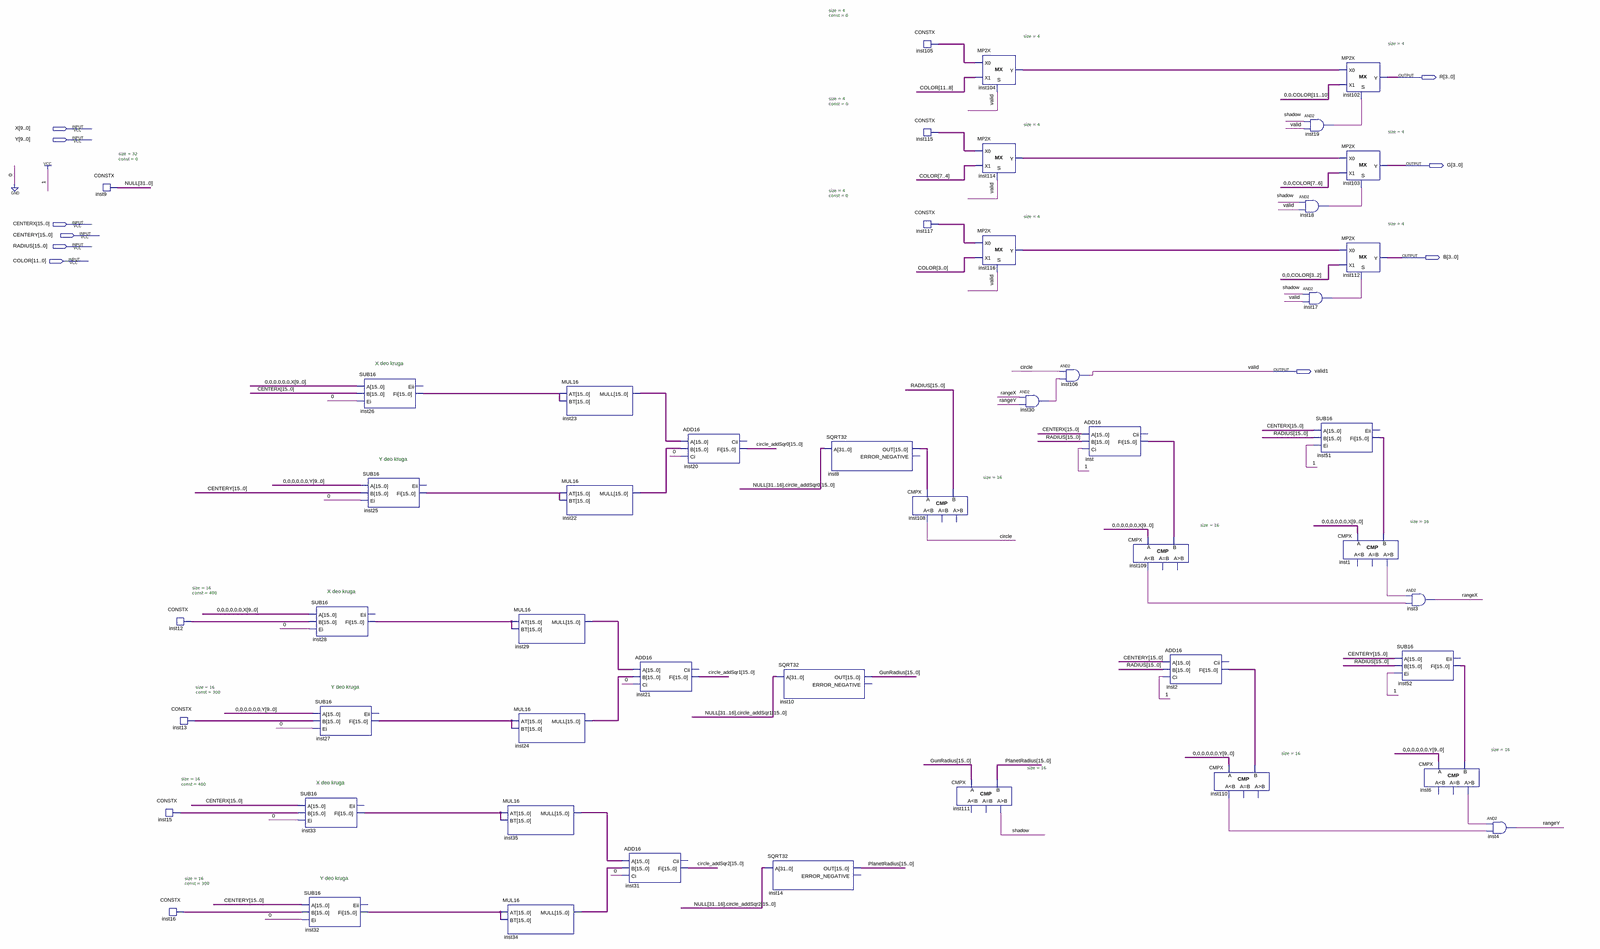
[diagram p0: schematic sheet, whole]
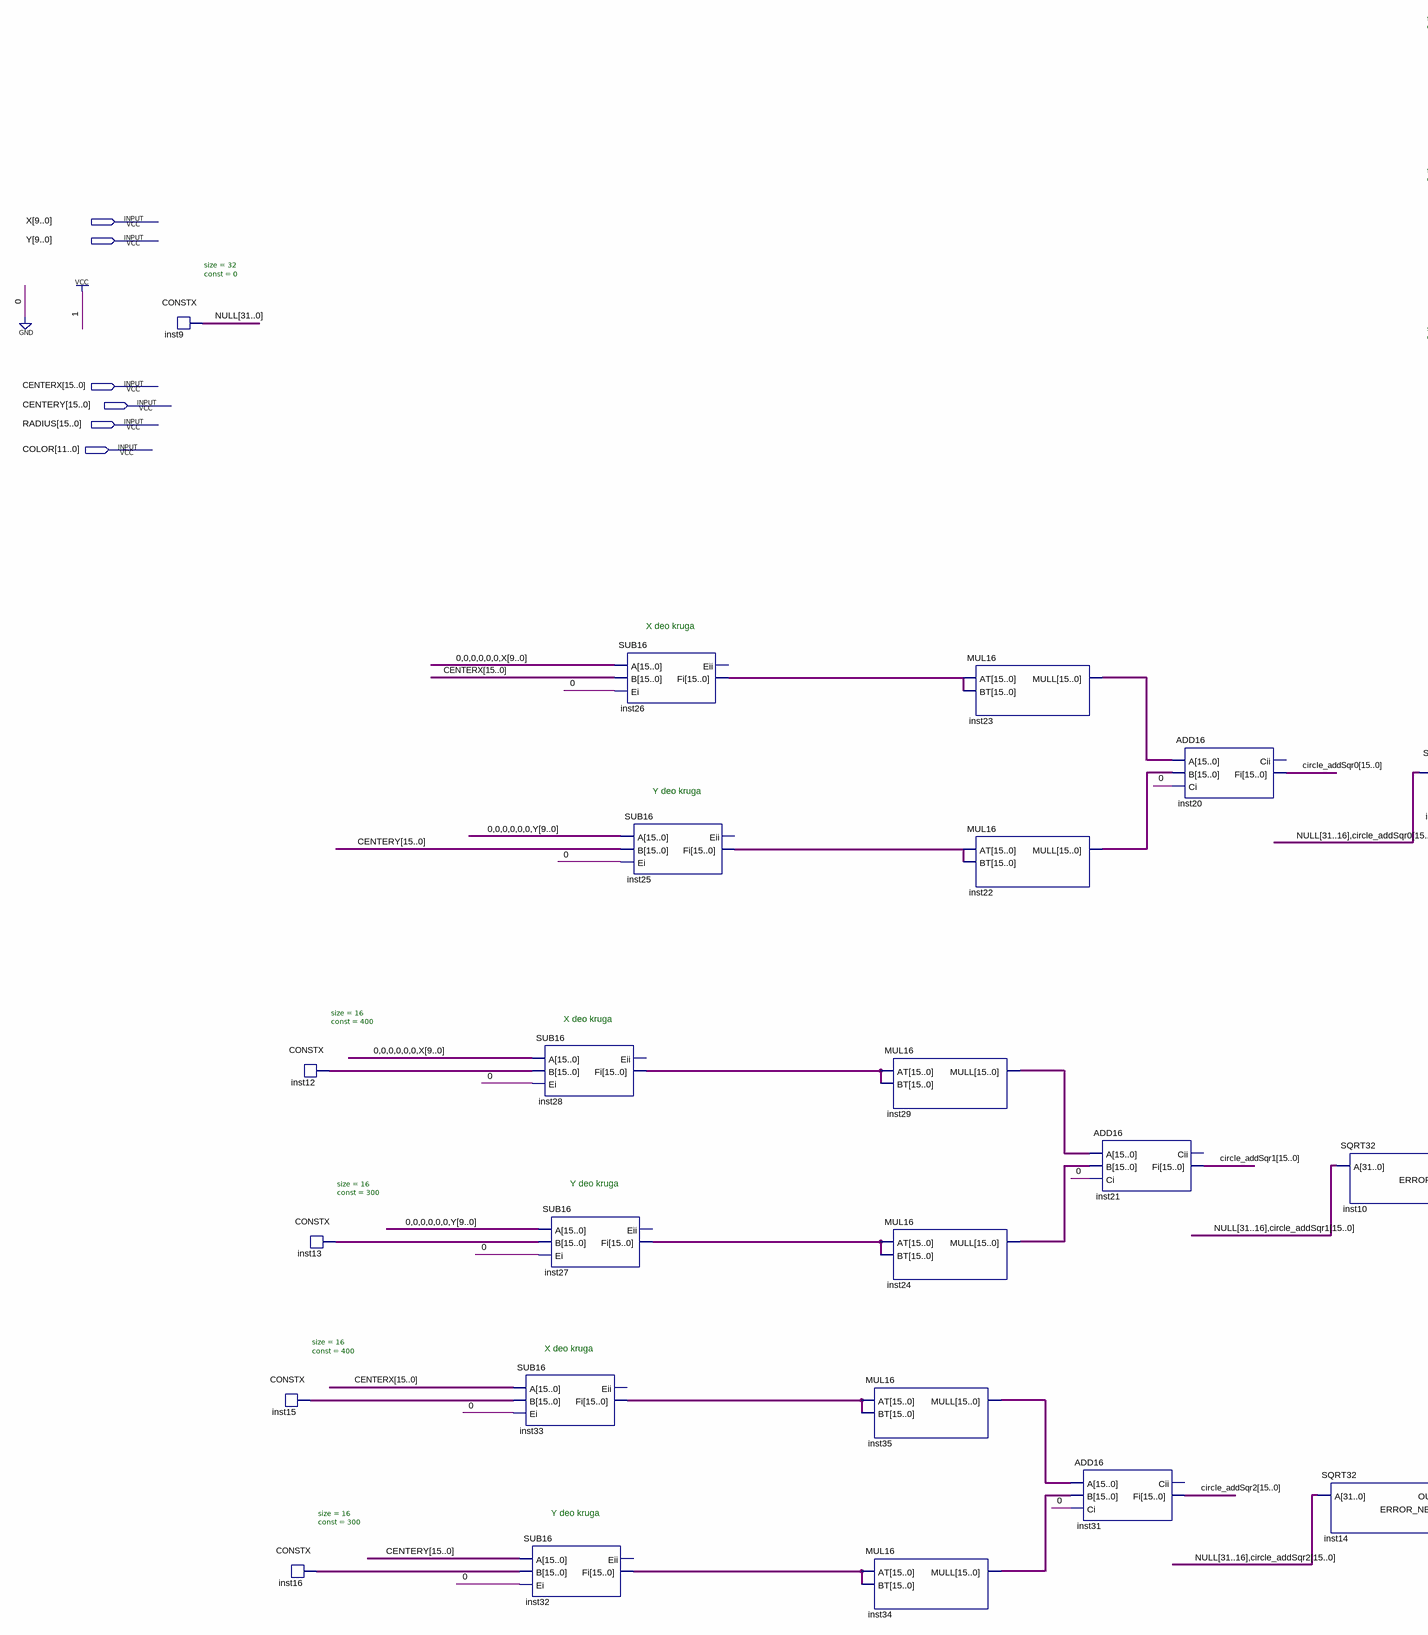
[diagram p1: schematic sheet, left part]
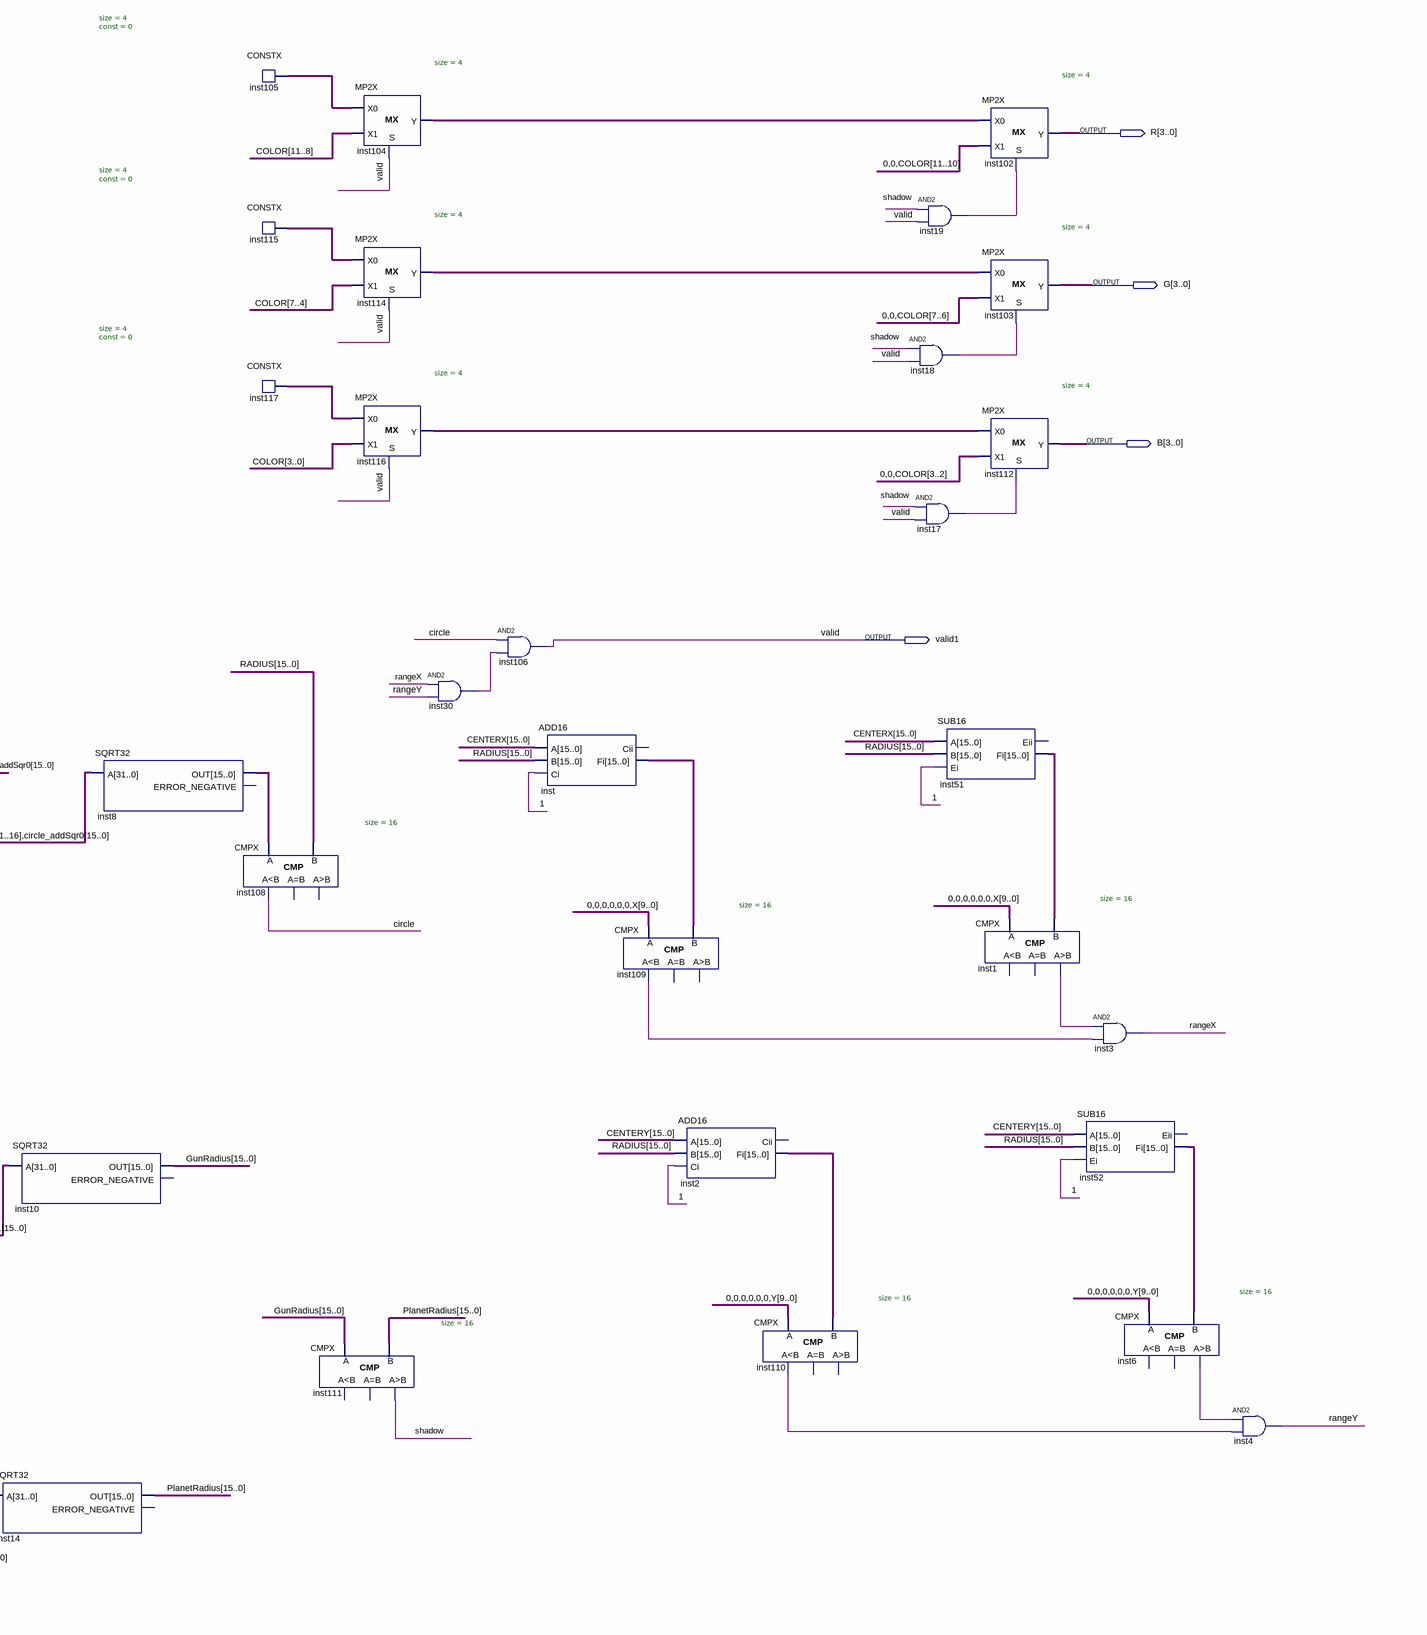
[diagram p2: schematic sheet, right part]
// Quartus schematic drawPlanet.bdf as structural Verilog: 49 symbols, 10 pins
module drawPlanet (
  input  [9:0] X,
  input  [9:0] Y,
  input  [15:0] CENTERX,
  input  [15:0] CENTERY,
  input  [15:0] RADIUS,
  input  [11:0] COLOR,
  output [3:0] R,
  output [3:0] G,
  output [3:0] B,
  output valid1
);

  wire circle, inst1_gr, inst6_gr, inst17_out, inst18_out, inst19_out, inst30_out, inst109_ls, inst110_ls,
       rangeX, rangeY, shadow;
  wire [3:0] inst104_y, inst105_data, inst114_y, inst115_data, inst116_y, inst117_data;
  wire [15:0] circle_addSqr0, circle_addSqr1, circle_addSqr2, GunRadius, inst2_fi, inst8_out, inst12_data,
       inst13_data, inst15_data, inst16_data, inst22_mull, inst23_mull, inst24_mull, inst25_fi, inst26_fi,
       inst27_fi, inst28_fi, inst29_mull, inst32_fi, inst33_fi, inst34_mull, inst35_mull, inst51_fi,
       inst52_fi, inst_fi, PlanetRadius;
  wire [31:0] NULL;

  CONSTX #(.size(32), .\const (0)) inst9 (.data(NULL));
  CONSTX #(.size(16), .\const (400)) inst12 (.data(inst12_data));
  CONSTX #(.size(16), .\const (300)) inst13 (.data(inst13_data));
  CONSTX #(.size(16), .\const (400)) inst15 (.data(inst15_data));
  CONSTX #(.size(16), .\const (300)) inst16 (.data(inst16_data));
  SUB16 inst28 (.A({{6{1'b0}}, X}), .B(inst12_data), .Ei(1'b0), .Fi(inst28_fi));  // open: Eii
  SUB16 inst27 (.A({{6{1'b0}}, Y}), .B(inst13_data), .Ei(1'b0), .Fi(inst27_fi));  // open: Eii
  SUB16 inst33 (.A(CENTERX), .B(inst15_data), .Ei(1'b0), .Fi(inst33_fi));  // open: Eii
  SUB16 inst32 (.A(CENTERY), .B(inst16_data), .Ei(1'b0), .Fi(inst32_fi));  // open: Eii
  SUB16 inst26 (.A({{6{1'b0}}, X}), .B(CENTERX), .Ei(1'b0), .Fi(inst26_fi));  // open: Eii
  SUB16 inst25 (.A({{6{1'b0}}, Y}), .B(CENTERY), .Ei(1'b0), .Fi(inst25_fi));  // open: Eii
  MUL16 inst35 (.AT(inst33_fi), .BT(inst33_fi), .MULL(inst35_mull));
  MUL16 inst34 (.AT(inst32_fi), .BT(inst32_fi), .MULL(inst34_mull));
  MUL16 inst29 (.AT(inst28_fi), .BT(inst28_fi), .MULL(inst29_mull));
  MUL16 inst24 (.AT(inst27_fi), .BT(inst27_fi), .MULL(inst24_mull));
  MUL16 inst23 (.AT(inst26_fi), .BT(inst26_fi), .MULL(inst23_mull));
  MUL16 inst22 (.AT(inst25_fi), .BT(inst25_fi), .MULL(inst22_mull));
  ADD16 inst21 (.A(inst29_mull), .B(inst24_mull), .Ci(1'b0), .Fi(circle_addSqr1));  // open: Cii
  ADD16 inst31 (.A(inst35_mull), .B(inst34_mull), .Ci(1'b0), .Fi(circle_addSqr2));  // open: Cii
  ADD16 inst20 (.A(inst23_mull), .B(inst22_mull), .Ci(1'b0), .Fi(circle_addSqr0));  // open: Cii
  SQRT32 inst14 (.A({NULL[31:16], circle_addSqr2}), .OUT(PlanetRadius));  // open: ERROR_NEGATIVE
  SQRT32 inst10 (.A({NULL[31:16], circle_addSqr1}), .OUT(GunRadius));  // open: ERROR_NEGATIVE
  SQRT32 inst8 (.A({NULL[31:16], circle_addSqr0}), .OUT(inst8_out));  // open: ERROR_NEGATIVE
  CONSTX #(.size(4), .\const (0)) inst105 (.data(inst105_data));
  CONSTX #(.size(4), .\const (0)) inst115 (.data(inst115_data));
  CONSTX #(.size(4), .\const (0)) inst117 (.data(inst117_data));
  CMPX #(.size(16)) inst108 (.A(inst8_out), .B(RADIUS), .ls(circle));  // open: eq, gr
  CMPX #(.size(16)) inst111 (.A(GunRadius), .B(PlanetRadius), .gr(shadow));  // open: ls, eq
  MP2X #(.size(4)) inst104 (.S(valid1), .X0(inst105_data), .X1(COLOR[11:8]), .Y(inst104_y));
  MP2X #(.size(4)) inst114 (.S(valid1), .X0(inst115_data), .X1(COLOR[7:4]), .Y(inst114_y));
  MP2X #(.size(4)) inst116 (.S(valid1), .X0(inst117_data), .X1(COLOR[3:0]), .Y(inst116_y));
  and inst30 (inst30_out, rangeX, rangeY);
  and inst106 (valid1, circle, inst30_out);
  ADD16 inst (.A(CENTERX), .B(RADIUS), .Ci(1'b1), .Fi(inst_fi));  // open: Cii
  CMPX #(.size(16)) inst109 (.A({{6{1'b0}}, X}), .B(inst_fi), .ls(inst109_ls));  // open: eq, gr
  ADD16 inst2 (.A(CENTERY), .B(RADIUS), .Ci(1'b1), .Fi(inst2_fi));  // open: Cii
  CMPX #(.size(16)) inst110 (.A({{6{1'b0}}, Y}), .B(inst2_fi), .ls(inst110_ls));  // open: eq, gr
  and inst19 (inst19_out, shadow, valid1);
  and inst18 (inst18_out, shadow, valid1);
  and inst17 (inst17_out, shadow, valid1);
  SUB16 inst51 (.A(CENTERX), .B(RADIUS), .Ei(1'b1), .Fi(inst51_fi));  // open: Eii
  MP2X #(.size(4)) inst102 (.S(inst19_out), .X0(inst104_y), .X1({2'b00, COLOR[11:10]}), .Y(R));
  MP2X #(.size(4)) inst103 (.S(inst18_out), .X0(inst114_y), .X1({2'b00, COLOR[7:6]}), .Y(G));
  MP2X #(.size(4)) inst112 (.S(inst17_out), .X0(inst116_y), .X1({2'b00, COLOR[3:2]}), .Y(B));
  CMPX #(.size(16)) inst1 (.A({{6{1'b0}}, X}), .B(inst51_fi), .gr(inst1_gr));  // open: ls, eq
  and inst3 (rangeX, inst1_gr, inst109_ls);
  SUB16 inst52 (.A(CENTERY), .B(RADIUS), .Ei(1'b1), .Fi(inst52_fi));  // open: Eii
  CMPX #(.size(16)) inst6 (.A({{6{1'b0}}, Y}), .B(inst52_fi), .gr(inst6_gr));  // open: ls, eq
  and inst4 (rangeY, inst6_gr, inst110_ls);

  // Other names for the same wires on the sheet: valid = valid1

  // Notes on the sheet:
  //   X deo kruga
  //   Y deo kruga
  //   X deo kruga
  //   Y deo kruga
  //   X deo kruga
  //   Y deo kruga
endmodule
